# Altium schematic sheet FPGA_Bank2.SchDoc
size B
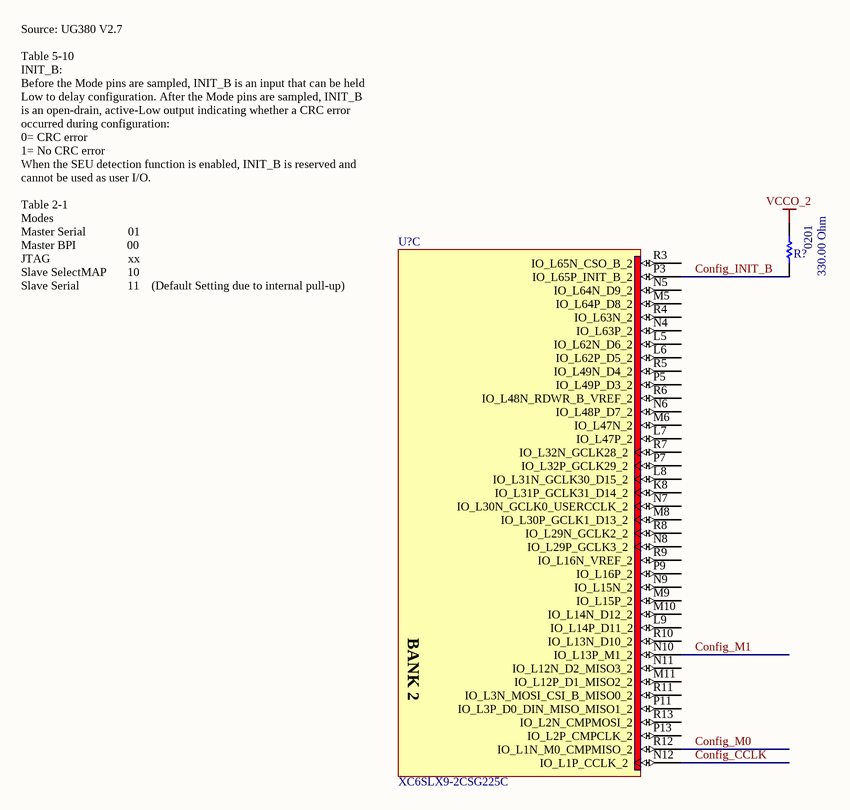
[diagram p0: FPGA_Bank2.SchDoc]

## Parts
R?  value 330.00 Ohm  Case-EIA: 0201  [RESC0201(0603)_M]  (hidden comment: 330R 1% 0201(0603))
U?  XC6SLX9-2CSG225C  [CSG225]  (part C of 7)

## Nets
VCCO_2: R?.2
Config_CCLK: U?.N12(IO_L1P_CCLK_2)
Config_INIT_B: R?.1 U?.P3(IO_L65P_INIT_B_2)
Config_M0: U?.R12(IO_L1N_M0_CMPMISO_2)
Config_M1: U?.N10(IO_L13P_M1_2)

Not connected (* = marked no-connect by the designer): U? K8(IO_L31P_GCLK31_D14_2) L5(IO_L62N_D6_2) L6(IO_L62P_D5_2) L7(IO_L47P_2) L8(IO_L31N_GCLK30_D15_2) L9(IO_L14P_D11_2) M5(IO_L64P_D8_2) M6(IO_L47N_2) M8(IO_L30P_GCLK1_D13_2) M9(IO_L15P_2) M10(IO_L14N_D12_2) M11(IO_L12P_D1_MISO2_2) N4(IO_L63P_2) N5(IO_L64N_D9_2) N6(IO_L48P_D7_2) N7(IO_L30N_GCLK0_USERCCLK_2) N8(IO_L29P_GCLK3_2) N9(IO_L15N_2) N11(IO_L12N_D2_MISO3_2) P5(IO_L49P_D3_2) P7(IO_L32P_GCLK29_2) P9(IO_L16P_2) P11(IO_L3P_D0_DIN_MISO_MISO1_2) P13(IO_L2P_CMPCLK_2) R3(IO_L65N_CSO_B_2) R4(IO_L63N_2) R5(IO_L49N_D4_2) R6(IO_L48N_RDWR_B_VREF_2) R7(IO_L32N_GCLK28_2) R8(IO_L29N_GCLK2_2) R9(IO_L16N_VREF_2) R10(IO_L13N_D10_2) R11(IO_L3N_MOSI_CSI_B_MISO0_2) R13(IO_L2N_CMPMOSI_2)

## Notes on the sheet
- Source: UG380 V2.7
  Table 5-10
  INIT_B:
  Before the Mode pins are sampled, INIT_B is an input that can be held
  Low to delay configuration. After the Mode pins are sampled, INIT_B
  is an open-drain, active-Low output indicating whether a CRC error
  occurred during configuration:
  0= CRC error
  1= No CRC error
  When the SEU detection function is enabled, INIT_B is reserved and
  cannot be used as user I/O.
  Table 2-1
  Modes
  Master Serial              01
  Master BPI                 00
  JTAG                          xx
  Slave SelectMAP       10
  Slave Serial                11    (Default Setting due to internal pull-up)
- (in symbol XC6SLX9-2CSG225C, part C) BANK 2

## Library data of the parts
R? = CMP-1010-00360-1: 330R 0.05W 1% 0201 (0603 Metric)  SMD; Case-Metric: 0603; Power: 0.05 W; Tolerance: 1 %; Technology: SMT
U? = XC6SLX9-2CSG225C: Spartan-6 LX 1.2V FPGA, 160 User I/Os, 225-Ball Chip-Scale BGA (0.8mm Pitch), Speed Grade 2, Commercial Grade, Pb-Free; DatasheetVersion: ver1.6, Nov-2010; PackageVersion: ver1.1, Nov-2009; PackageReference: CSG225; PackageDescription: 225-Ball Chip-Scale BGA (CSG225) Package, 0.8 mm Pitch; Code_JEDEC: MO-275-HHAC-1; ComponentLink1Description: Manufacturer URL; ComponentLink1URL: http://www.xilinx.com/; ComponentLink2Description: Spartan-6 Datasheet; ComponentLink2URL: http://www.xilinx.com/support/documentation/data_sheets/ds160.pdf; ComponentLink3Description: Spartan-6 Documents; ComponentLink3URL: http://www.xilinx.com/support/documentation/spartan-6.htm